# EAGLE design cactusCup_v1 (EAGLE 8.0.0)
A micro-controller designed to fit into an express card slot and become an integrated part of the computer
COMPANY: ADAFRUIT INDUSTRIES; DRAWN: KTOWN; REV: B
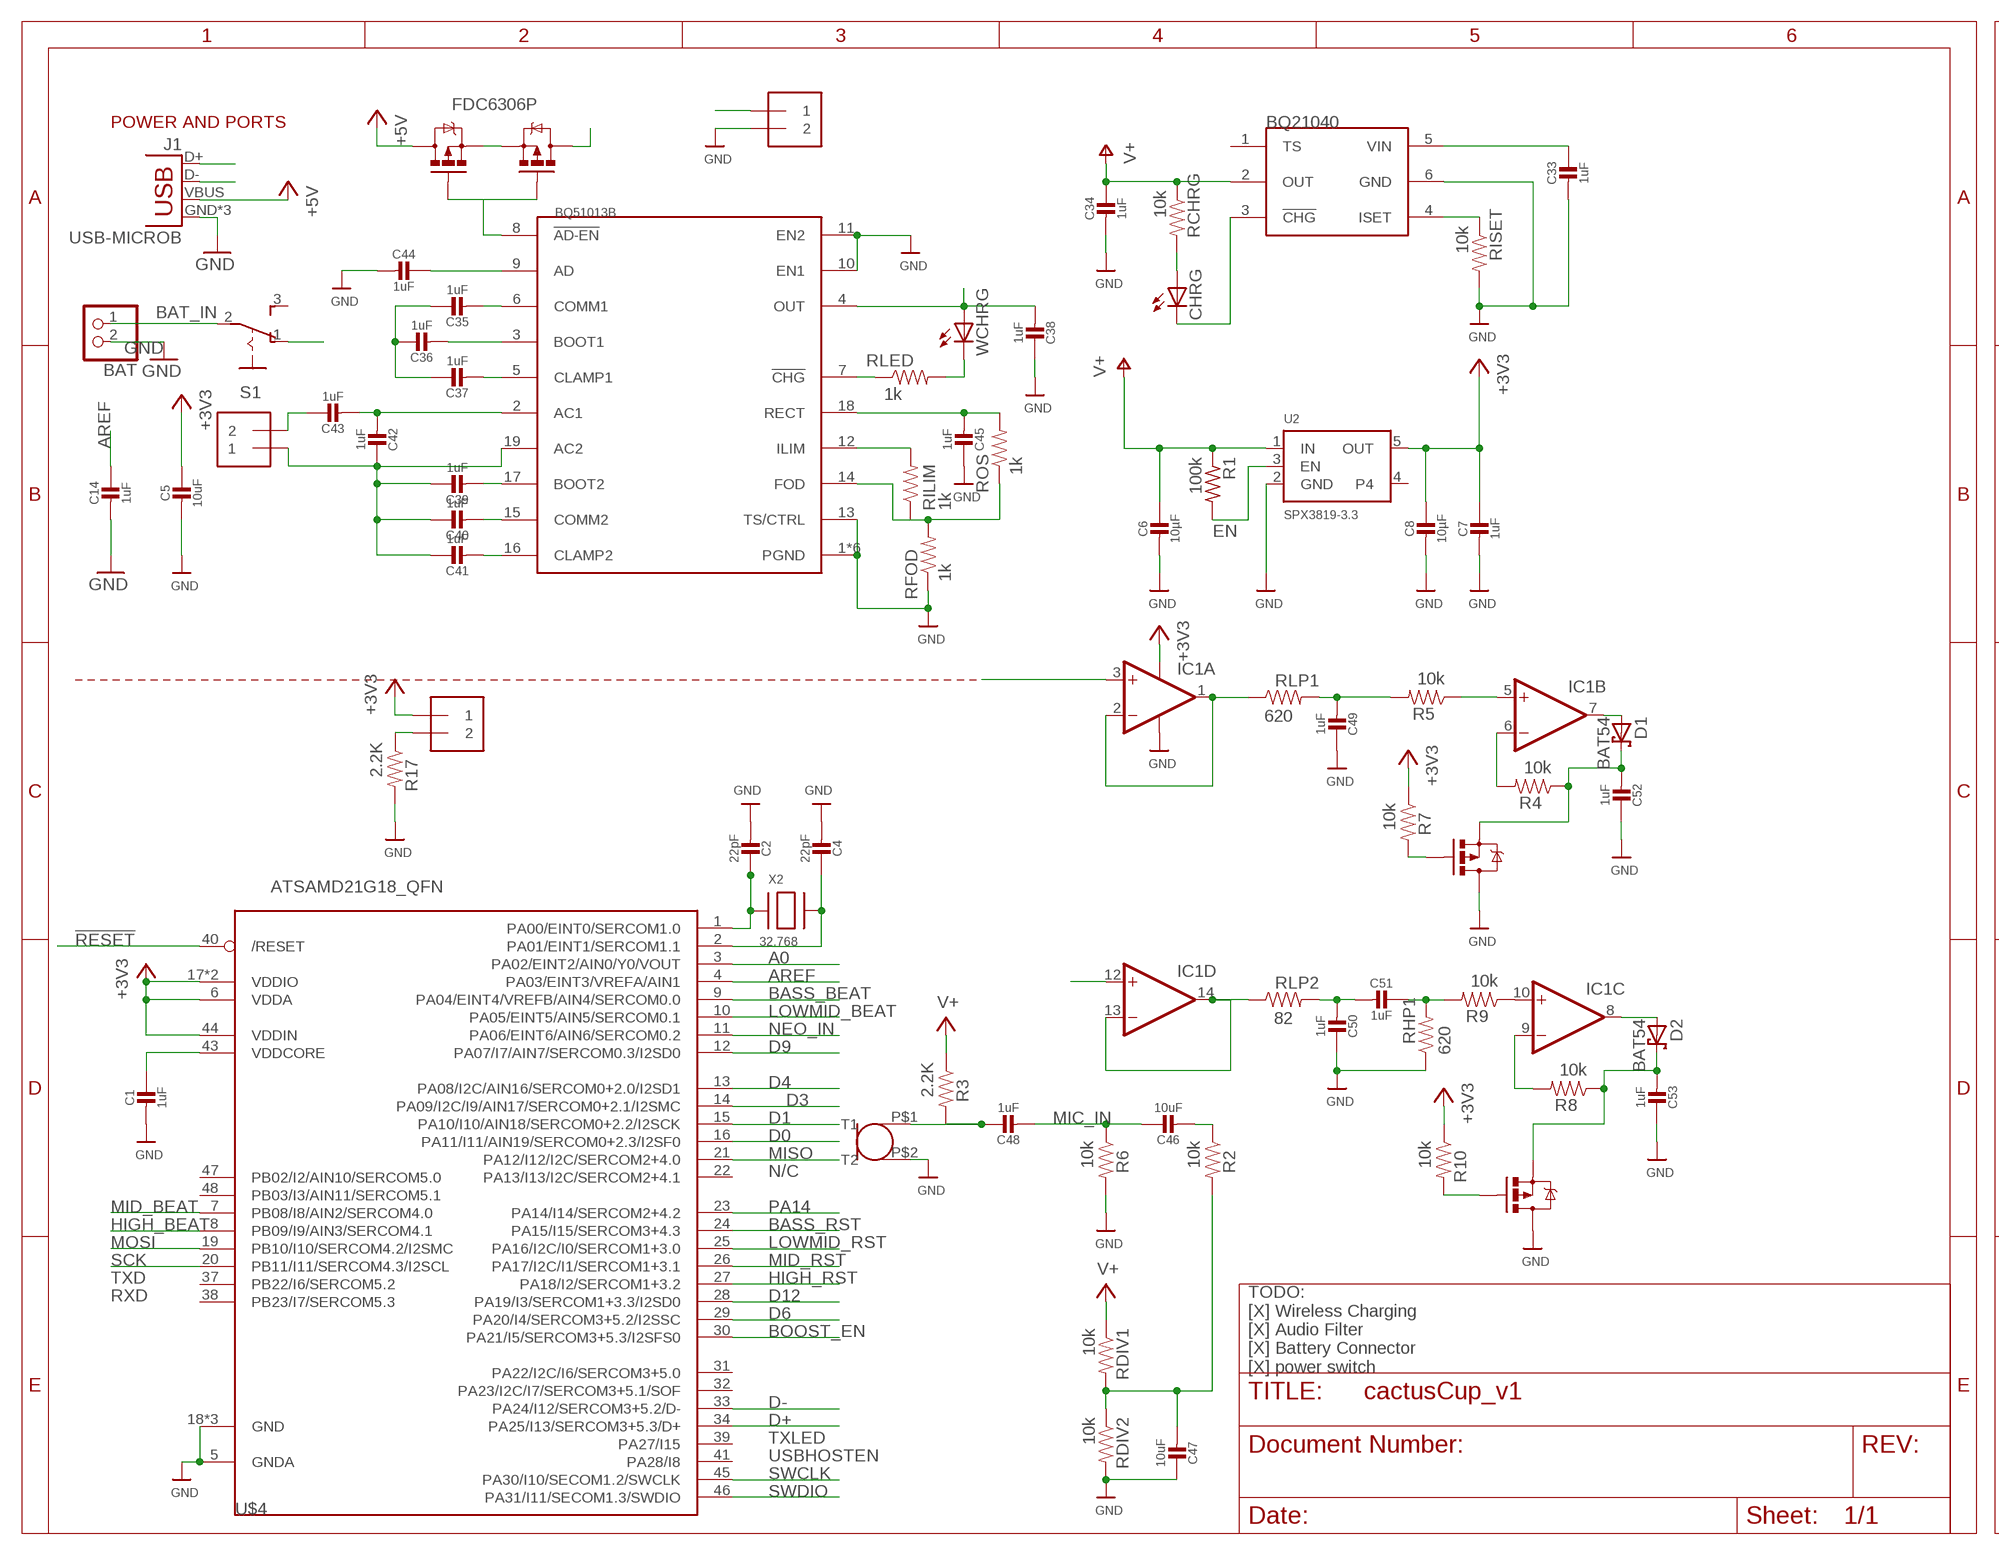
[diagram p0: schematic, sheet 1, part 1 of 2]
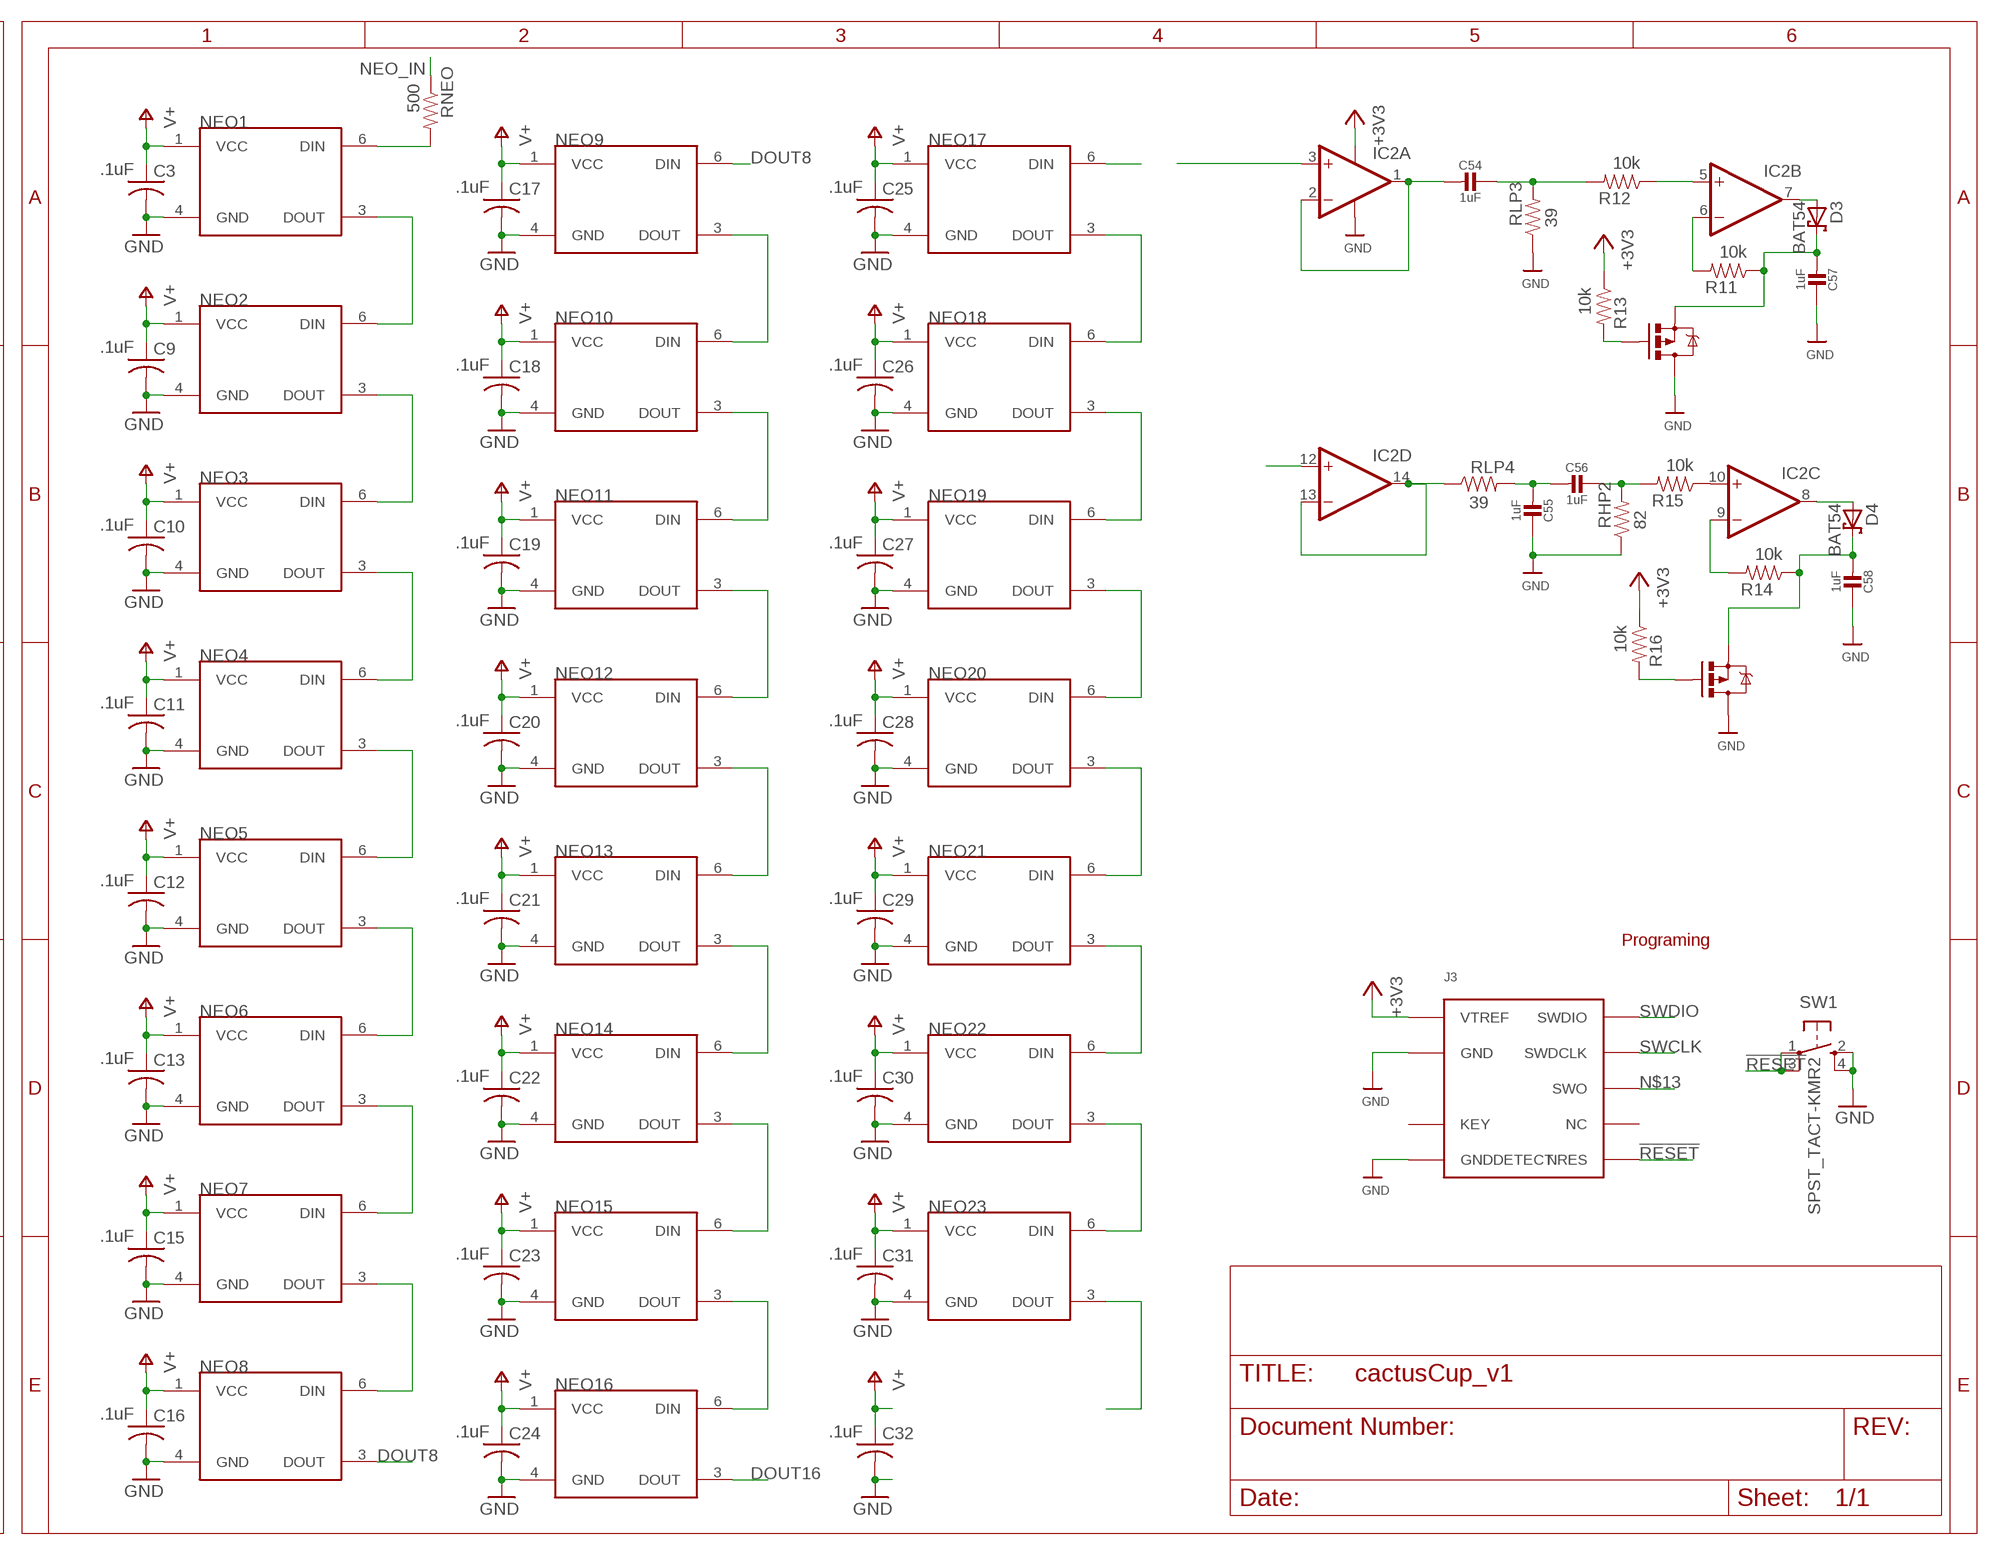
[diagram p1: schematic, sheet 1, part 2 of 2]

## Parts
BAT  JST_2PIN-SMT-RA  [JST-PH-2-SMT-RA]
BQ21040  BQ21040  [SOT23-6]
BQ51013B  BQ51013B  [R-PQFP-N20]
C1  1uF  CAP_CERAMIC0603_NO  [0603-NO]
C2  22pF  CAP_CERAMIC0603_NO  [0603-NO]
C3  .1uF  C-USC0603  [C0603]
C4  22pF  CAP_CERAMIC0603_NO  [0603-NO]
C5  10uF  CAP_CERAMIC0805-NOOUTLINE  [0805-NO]
C6  10µF  CAP_CERAMIC0805-NOOUTLINE  [0805-NO]
C7  1uF  CAP_CERAMIC0603_NO  [0603-NO]
C8  10µF  CAP_CERAMIC0805-NOOUTLINE  [0805-NO]
C9  .1uF  C-USC0603  [C0603]
C10  .1uF  C-USC0603  [C0603]
C11  .1uF  C-USC0603  [C0603]
C12  .1uF  C-USC0603  [C0603]
C13  .1uF  C-USC0603  [C0603]
C14  1uF  CAP_CERAMIC0603_NO  [0603-NO]
C15  .1uF  C-USC0603  [C0603]
C16  .1uF  C-USC0603  [C0603]
C17  .1uF  C-USC0603  [C0603]
C18  .1uF  C-USC0603  [C0603]
C19  .1uF  C-USC0603  [C0603]
C20  .1uF  C-USC0603  [C0603]
C21  .1uF  C-USC0603  [C0603]
C22  .1uF  C-USC0603  [C0603]
C23  .1uF  C-USC0603  [C0603]
C24  .1uF  C-USC0603  [C0603]
C25  .1uF  C-USC0603  [C0603]
C26  .1uF  C-USC0603  [C0603]
C27  .1uF  C-USC0603  [C0603]
C28  .1uF  C-USC0603  [C0603]
C29  .1uF  C-USC0603  [C0603]
C30  .1uF  C-USC0603  [C0603]
C31  .1uF  C-USC0603  [C0603]
C32  .1uF  C-USC0603  [C0603]
C33  1uF  CAP_CERAMIC0603_NO  [0603-NO]
C34  1uF  CAP_CERAMIC0603_NO  [0603-NO]
C35  1uF  CAP_CERAMIC0603_NO  [0603-NO]
C36  1uF  CAP_CERAMIC0603_NO  [0603-NO]
C37  1uF  CAP_CERAMIC0603_NO  [0603-NO]
C38  1uF  CAP_CERAMIC0603_NO  [0603-NO]
C39  1uF  CAP_CERAMIC0603_NO  [0603-NO]
C40  1uF  CAP_CERAMIC0603_NO  [0603-NO]
C41  1uF  CAP_CERAMIC0603_NO  [0603-NO]
C42  1uF  CAP_CERAMIC0603_NO  [0603-NO]
C43  1uF  CAP_CERAMIC0603_NO  [0603-NO]
C44  1uF  CAP_CERAMIC0603_NO  [0603-NO]
C45  1uF  CAP_CERAMIC0603_NO  [0603-NO]
C46  10uF  CAP_CERAMIC0603_NO  [0603-NO]
C47  10uF  CAP_CERAMIC0603_NO  [0603-NO]
C48  1uF  CAP_CERAMIC0603_NO  [0603-NO]
C49  1uF  CAP_CERAMIC0603_NO  [0603-NO]
C50  1uF  CAP_CERAMIC0603_NO  [0603-NO]
C51  1uF  CAP_CERAMIC0603_NO  [0603-NO]
C52  1uF  CAP_CERAMIC0603_NO  [0603-NO]
C53  1uF  CAP_CERAMIC0603_NO  [0603-NO]
C54  1uF  CAP_CERAMIC0603_NO  [0603-NO]
C55  1uF  CAP_CERAMIC0603_NO  [0603-NO]
C56  1uF  CAP_CERAMIC0603_NO  [0603-NO]
C57  1uF  CAP_CERAMIC0603_NO  [0603-NO]
C58  1uF  CAP_CERAMIC0603_NO  [0603-NO]
CHRG  LEDCHIPLED_0603  [CHIPLED_0603]
COIL  1X2-3.5MM  [1X2-3.5MM]
D1  BAT54  [SOT23]
D2  BAT54  [SOT23]
D3  BAT54  [SOT23]
D4  BAT54  [SOT23]
IC1  QUAD_OPAMPTS  [TSSOP14]
IC2  QUAD_OPAMPTS  [TSSOP14]
J1  USB-MICROB  [USB-MICROB]
J2  1X2-3.5MM  [1X2-3.5MM]
J3  JLINK_10PIN  [FTSH-105-01-F-DH]
J4  1X2-3.5MM  [1X2-3.5MM]
NEO1  NEOPIXEL  [RGBLED5050]
NEO2  NEOPIXEL  [RGBLED5050]
NEO3  NEOPIXEL  [RGBLED5050]
NEO4  NEOPIXEL  [RGBLED5050]
NEO5  NEOPIXEL  [RGBLED5050]
NEO6  NEOPIXEL  [RGBLED5050]
NEO7  NEOPIXEL  [RGBLED5050]
NEO8  NEOPIXEL  [RGBLED5050]
NEO9  NEOPIXEL  [RGBLED5050]
NEO10  NEOPIXEL  [RGBLED5050]
NEO11  NEOPIXEL  [RGBLED5050]
NEO12  NEOPIXEL  [RGBLED5050]
NEO13  NEOPIXEL  [RGBLED5050]
NEO14  NEOPIXEL  [RGBLED5050]
NEO15  NEOPIXEL  [RGBLED5050]
NEO16  NEOPIXEL  [RGBLED5050]
NEO17  NEOPIXEL  [RGBLED5050]
NEO18  NEOPIXEL  [RGBLED5050]
NEO19  NEOPIXEL  [RGBLED5050]
NEO20  NEOPIXEL  [RGBLED5050]
NEO21  NEOPIXEL  [RGBLED5050]
NEO22  NEOPIXEL  [RGBLED5050]
NEO23  NEOPIXEL  [RGBLED5050]
R1  100k  R-US_R0603  [R0603]
R2  10k  0.27OHM-1/10W-1%(0603)  [0603-RES]
R3  2.2K  0.27OHM-1/10W-1%(0603)  [0603-RES]
R4  10k  0.27OHM-1/10W-1%(0603)  [0603-RES]
R5  10k  0.27OHM-1/10W-1%(0603)  [0603-RES]
R6  10k  0.27OHM-1/10W-1%(0603)  [0603-RES]
R7  10k  0.27OHM-1/10W-1%(0603)  [0603-RES]
R8  10k  0.27OHM-1/10W-1%(0603)  [0603-RES]
R9  10k  0.27OHM-1/10W-1%(0603)  [0603-RES]
R10  10k  0.27OHM-1/10W-1%(0603)  [0603-RES]
R11  10k  0.27OHM-1/10W-1%(0603)  [0603-RES]
R12  10k  0.27OHM-1/10W-1%(0603)  [0603-RES]
R13  10k  0.27OHM-1/10W-1%(0603)  [0603-RES]
R14  10k  0.27OHM-1/10W-1%(0603)  [0603-RES]
R15  10k  0.27OHM-1/10W-1%(0603)  [0603-RES]
R16  10k  0.27OHM-1/10W-1%(0603)  [0603-RES]
R17  2.2K  0.27OHM-1/10W-1%(0603)  [0603-RES]
RCHRG  10k  0.27OHM-1/10W-1%(0603)  [0603-RES]
RDIV1  10k  0.27OHM-1/10W-1%(0603)  [0603-RES]
RDIV2  10k  0.27OHM-1/10W-1%(0603)  [0603-RES]
RFOD  1k  0.27OHM-1/10W-1%(0603)  [0603-RES]
RHP1  620  0.27OHM-1/10W-1%(0603)  [0603-RES]
RHP2  82  0.27OHM-1/10W-1%(0603)  [0603-RES]
RILIM  1k  0.27OHM-1/10W-1%(0603)  [0603-RES]
RISET  10k  0.27OHM-1/10W-1%(0603)  [0603-RES]
RLED  1k  0.27OHM-1/10W-1%(0603)  [0603-RES]
RLP1  620  0.27OHM-1/10W-1%(0603)  [0603-RES]
RLP2  82  0.27OHM-1/10W-1%(0603)  [0603-RES]
RLP3  39  0.27OHM-1/10W-1%(0603)  [0603-RES]
RLP4  39  0.27OHM-1/10W-1%(0603)  [0603-RES]
RNEO  500  0.27OHM-1/10W-1%(0603)  [0603-RES]
ROS  1k  0.27OHM-1/10W-1%(0603)  [0603-RES]
S1  255SB  [255SB]
SW1  SPST_TACT-KMR2  [KMR2]
U2  SPX3819-3.3  VREG_SOT23-5  [SOT23-5]
U$3  FDC6306P  [SOT-23_6]
U$4  ATSAMD21G18_QFN  ATSAMD21J  [TQFP48]
U$19  CMA-4544PF-W  [CMA_MIC]
U$25  FDC6306P  [SOT-23_6]
U$37  FDC6306P  [SOT-23_6]
WCHRG  LEDCHIPLED_0603  [CHIPLED_0603]
X2  32.768  XTAL-3.2X1.5  [XTAL3215]

## Nets
!AD-EN: BQ51013B.8(!AD-EN) U$3.1(G) U$3.3(G)
!RESET: J3.10(NRES) SW1.1(P) SW1.3(P1) U$4.40(/RESET)
+1V5: C47.2 R2.2 RDIV1.2 RDIV2.1
+3V3: C5.1 C7.1 C8.1 IC1.4(A:V+) IC2.4(A:V+) J2.1 J3.1(VTREF) R3.1 R7.1 R10.1 R13.1 R16.1 RDIV1.1 U2.5(OUT) U$4.6(VDDA) U$4.17(VDDIO) U$4.36(VDDIO) U$4.44(VDDIN) ; supply symbol labelled V+
A0: U$4.3(PA02/EINT2/AIN0/Y0/VOUT)
AREF: C14.1 U$4.4(PA03/EINT3/VREFA/AIN1)
AUDIO_IN: C46.2 IC1.3(A:+IN) IC1.12(D:+IN) IC2.3(A:+IN) IC2.12(D:+IN) R2.1
BASS_BEAT: C52.2 D1.3(C) R4.1 U$4.9(PA04/EINT4/VREFB/AIN4/SERCOM0.0) U$25.5(S)
BASS_RST: R7.2 U$4.24(PA15/I15/SERCOM3+4.3) U$25.1(G)
BAT_IN: BAT.1 S1.2(P)
BOOST_EN: U$4.30(PA21/I5/SERCOM3+5.3/I2SFS0)
D0: U$4.16(PA11/I11/AIN19/SERCOM0+2.3/I2SF0)
D1: U$4.15(PA10/I10/AIN18/SERCOM0+2.2/I2SCK)
D3: U$4.14(PA09/I2C/I9/AIN17/SERCOM0+2.1/I2SMC)
D4: U$4.13(PA08/I2C/AIN16/SERCOM0+2.0/I2SD1)
D6: J2.2 R17.1 U$4.29(PA20/I4/SERCOM3+5.2/I2SSC)
D9: U$4.12(PA07/I7/AIN7/SERCOM0.3/I2SD0)
D12: U$4.28(PA19/I3/SERCOM1+3.3/I2SD0)
D+: J1.D+ U$4.34(PA25/I13/SERCOM3+5.3/D+)
D-: J1.D- U$4.33(PA24/I12/SERCOM3+5.2/D-)
DOUT8: NEO8.3(DOUT) NEO9.6(DIN)
DOUT16: NEO16.3(DOUT) NEO17.6(DIN)
EN: R1.2 U2.3(EN)
GND: BAT.2 BQ21040.6(GND) BQ51013B.1(PGND) BQ51013B.10(EN1) BQ51013B.11(EN2) BQ51013B.13(TS/CTRL) BQ51013B.20(PGND) BQ51013B.E@1(PGND) BQ51013B.E@2(PGND) BQ51013B.E@3(PGND) BQ51013B.E@4(PGND) C1.2 C2.2 C3.2 C4.2 C5.2 C6.2 C7.2 C8.2 C9.2 C10.2 C11.2 C12.2 C13.2 C14.2 C15.2 C16.2 C17.2 C18.2 C19.2 C20.2 C21.2 C22.2 C23.2 C24.2 C25.2 C26.2 C27.2 C28.2 C29.2 C30.2 C31.2 C32.2 C33.2 C34.2 C38.1 C44.2 C45.1 C47.1 C49.1 C50.1 C52.1 C53.1 C55.1 C57.1 C58.1 IC1.11(A:V-) IC2.11(A:V-) J1.GND J1.MT1(GND) J1.MT2(GND) J3.3(GND) J3.5(GND) J3.9(GNDDETECT) J4.2 NEO1.4(GND) NEO2.4(GND) NEO3.4(GND) NEO4.4(GND) NEO5.4(GND) NEO6.4(GND) NEO7.4(GND) NEO8.4(GND) NEO9.4(GND) NEO10.4(GND) NEO11.4(GND) NEO12.4(GND) NEO13.4(GND) NEO14.4(GND) NEO15.4(GND) NEO16.4(GND) NEO17.4(GND) NEO18.4(GND) NEO19.4(GND) NEO20.4(GND) NEO21.4(GND) NEO22.4(GND) NEO23.4(GND) R6.2 R17.2 RDIV2.2 RFOD.1 RHP1.1 RHP2.1 RISET.2 RLP3.1 SW1.2(S) SW1.4(S1) U2.2(GND) U$4.5(GNDA) U$4.18(GND) U$4.35(GND) U$4.42(GND) U$19.P$2(T2) U$25.4(D) U$25.6(D) U$37.4(D) U$37.6(D)
HIGH_BEAT: C57.2 D3.3(C) R11.1 U$4.8(PB09/I9/AIN3/SERCOM4.1) U$37.5(S)
HIGH_RST: R13.2 U$4.27(PA18/I2/SERCOM1+3.2) U$37.1(G)
LOWMID_BEAT: C53.2 D2.3(C) R8.1 U$4.10(PA05/EINT5/AIN5/SERCOM0.1) U$25.2(S)
LOWMID_RST: R10.2 U$4.25(PA16/I2C/I0/SERCOM1+3.0) U$25.3(G)
MIC_IN: C46.1 C48.2 R6.1
MID_BEAT: C58.2 D4.3(C) R14.1 U$4.7(PB08/I8/AIN2/SERCOM4.0) U$37.2(S)
MID_RST: R16.2 U$4.26(PA17/I2C/I1/SERCOM1+3.1) U$37.3(G)
MISO: U$4.21(PA12/I12/I2C/SERCOM2+4.0)
MOSI: U$4.19(PB10/I10/SERCOM4.2/I2SMC)
N$1: NEO1.3(DOUT) NEO2.6(DIN)
N$2: NEO3.3(DOUT) NEO4.6(DIN)
N$3: NEO2.3(DOUT) NEO3.6(DIN)
N$4: NEO5.3(DOUT) NEO6.6(DIN)
N$5: C2.1 U$4.1(PA00/EINT0/SERCOM1.0) X2.P$1
N$6: NEO7.3(DOUT) NEO8.6(DIN)
N$7: C4.1 U$4.2(PA01/EINT1/SERCOM1.1) X2.P$2
N$8: NEO6.3(DOUT) NEO7.6(DIN)
N$9: NEO4.3(DOUT) NEO5.6(DIN)
N$10: NEO9.3(DOUT) NEO10.6(DIN)
N$11: NEO11.3(DOUT) NEO12.6(DIN)
N$12: NEO10.3(DOUT) NEO11.6(DIN)
N$13: J3.6(SWO)
N$14: NEO13.3(DOUT) NEO14.6(DIN)
N$15: NEO15.3(DOUT) NEO16.6(DIN)
N$16: NEO14.3(DOUT) NEO15.6(DIN)
N$17: NEO12.3(DOUT) NEO13.6(DIN)
N$18: NEO17.3(DOUT) NEO18.6(DIN)
N$19: NEO19.3(DOUT) NEO20.6(DIN)
N$20: NEO18.3(DOUT) NEO19.6(DIN)
N$21: NEO21.3(DOUT) NEO22.6(DIN)
N$22: NEO23.3(DOUT)
N$23: NEO22.3(DOUT) NEO23.6(DIN)
N$24: NEO20.3(DOUT) NEO21.6(DIN)
N$25: CHRG.A RCHRG.2
N$26: BQ21040.3(!CHG) CHRG.C
N$27: BQ21040.4(ISET) RISET.1
N$28: NEO1.6(DIN) RNEO.2
N$29: BQ51013B.6(COMM1) C35.2
N$30: U$3.2(S) U$3.5(S)
N$31: BQ51013B.7(!CHG) RLED.1
N$32: C35.1 C36.1 C37.1
N$33: BQ51013B.3(BOOT1) C36.2
N$34: BQ51013B.5(CLAMP1) C37.2
N$35: BQ51013B.2(AC1) C42.2 C43.2
N$36: BQ51013B.19(AC2) C39.1 C40.1 C41.1 C42.1 COIL.1
N$37: BQ51013B.17(BOOT2) C39.2
N$38: BQ51013B.16(CLAMP2) C41.2
N$39: BQ51013B.15(COMM2) C40.2
N$40: BQ51013B.18(RECT) C45.2 ROS.2
N$41: BQ51013B.14(FOD) RFOD.2 RILIM.1 ROS.1
N$42: BQ51013B.12(ILIM) RILIM.2
N$43: C43.1 COIL.2
N$44: C48.1 R3.2 U$19.P$1(T1)
N$45: IC1.1(A:OUT) IC1.2(A:-IN) RLP1.1
N$46: C49.2 R5.2 RLP1.2
N$47: C50.2 C51.2 RLP2.2
N$48: C51.1 R9.2 RHP1.2
N$49: IC1.6(B:-IN) R4.2
N$50: IC1.5(B:+IN) R5.1
N$51: D1.1(A) IC1.7(B:OUT)
N$52: C54.2 IC2.1(A:OUT) IC2.2(A:-IN)
N$53: C54.1 R12.2 RLP3.2
N$54: IC1.10(C:+IN) R9.1
N$55: D2.1(A) IC1.8(C:OUT)
N$56: IC1.9(C:-IN) R8.2
N$57: IC1.13(D:-IN) IC1.14(D:OUT) RLP2.1
N$58: C55.2 C56.2 RLP4.2
N$59: C56.1 R15.2 RHP2.2
N$60: IC2.6(B:-IN) R11.2
N$61: IC2.5(B:+IN) R12.1
N$62: D3.1(A) IC2.7(B:OUT)
N$63: D4.1(A) IC2.8(C:OUT)
N$64: IC2.10(C:+IN) R15.1
N$65: IC2.9(C:-IN) R14.2
N$66: IC2.13(D:-IN) IC2.14(D:OUT) RLP4.1
NEO_IN: RNEO.1 U$4.11(PA06/EINT6/AIN6/SERCOM0.2)
PA14: U$4.23(PA14/I14/SERCOM2+4.2)
SCK: U$4.20(PB11/I11/SERCOM4.3/I2SCL)
SWCLK: J3.4(SWDCLK) U$4.45(PA30/I10/SECOM1.2/SWCLK)
SWDIO: J3.2(SWDIO) U$4.46(PA31/I11/SECOM1.3/SWDIO)
VBAT: BQ21040.2(OUT) C3.1 C6.1 C9.1 C10.1 C11.1 C12.1 C13.1 C15.1 C16.1 C17.1 C18.1 C19.1 C20.1 C21.1 C22.1 C23.1 C24.1 C25.1 C26.1 C27.1 C28.1 C29.1 C30.1 C31.1 C32.1 C34.1 NEO1.1(VCC) NEO2.1(VCC) NEO3.1(VCC) NEO4.1(VCC) NEO5.1(VCC) NEO6.1(VCC) NEO7.1(VCC) NEO8.1(VCC) NEO9.1(VCC) NEO10.1(VCC) NEO11.1(VCC) NEO12.1(VCC) NEO13.1(VCC) NEO14.1(VCC) NEO15.1(VCC) NEO16.1(VCC) NEO17.1(VCC) NEO18.1(VCC) NEO19.1(VCC) NEO20.1(VCC) NEO21.1(VCC) NEO22.1(VCC) NEO23.1(VCC) R1.1 RCHRG.1 S1.1(O) U2.1(IN) ; supply symbol labelled V+
VBUS: BQ21040.5(VIN) BQ51013B.4(OUT) C33.1 C38.2 J4.1 U$3.6(D) WCHRG.A
VDDCORE: C1.1 U$4.43(VDDCORE)
VUSB: BQ51013B.9(AD) C44.1 J1.VBUS U$3.4(D) ; supply symbol labelled +5V
WCHRG: RLED.2 WCHRG.C
Unconnected: BQ21040.1(TS) J3.7(KEY) J3.8(NC) S1.3(S) U2.4 U$4.22(PA13/I13/I2C/SERCOM2+4.1) U$4.31(PA22/I2C/I6/SERCOM3+5.0) U$4.32(PA23/I2C/I7/SERCOM3+5.1/SOF) U$4.37(PB22/I6/SERCOM5.2) U$4.38(PB23/I7/SERCOM5.3) U$4.39(PA27/I15) U$4.41(PA28/I8) U$4.47(PB02/I2/AIN10/SERCOM5.0) U$4.48(PB03/I3/AIN11/SERCOM5.1)

## Notes on the sheet
- POWER AND PORTS
- Programing
- N/C
- TXD
- RXD
- TODO:
  [X] Wireless Charging
  [X] Audio Filter
  [X] Battery Connector
  [X] power switch
- TXLED
- USBHOSTEN

## Library data of the parts
BAT = adafruit:JST_2PIN: JST 2-Pin Connectors of various flavors SMT-RA (S2B-PH-SM4) 4UConnector #17311 SMT (B2B-PH-SM4) THM-RA (S2B-PH) THM (B2B-PH)
BQ21040 = cactuscup:BQ21040
BQ51013B = cactuscup:BQ51013B
C1 C2 C4-C8 C14 C33-C58 = microbuilder:CAP_CERAMIC: Ceramic Capacitors For new designs, use the packages preceded by an '_' character since they are more reliable: The following footprints should be used on most boards: _0402 - Standard footprint for regular board layouts _0603 - Standard footprint for regular board layouts _0805 - Standard footprint for regular board layouts _1206 - Standard footprint for regular board layouts For extremely tight-pitch boards where space is at a premium, the following 'micro-pitch' footprints can be used (smaller pads, no silkscreen outline, etc.): _0402MP - Micro-pitch footprint for very dense/compact boards _0603MP - Micro-pitch footprint for very dense/compact boards _0805MP - Micro-pitch footprint for very dense/compact boards _1206MP - Micro-pitch footprint for very dense/compact boards
C3 C9-C13 C15-C32 = adafruit:C-US: CAPACITOR, American symbol
CHRG WCHRG = led:LED: LED OSRAM: - CHIPLED LG R971, LG N971, LY N971, LG Q971, LY Q971, LO R971, LY R971 LH N974, LH R974 LS Q976, LO Q976, LY Q976 LO Q996 - Hyper CHIPLED LW Q18S LB Q993, LB Q99A, LB R99A - SideLED LS A670, LO A670, LY A670, LG A670, LP A670 LB A673, LV A673, LT A673, LW A673 LH A674 LY A675 LS A676, LA A676, LO A676, LY A676, LW A676 LS A679, LY A679, LG A679 - Hyper Micro SIDELED® LS Y876, LA Y876, LO Y876, LY Y876 LT Y87S - SmartLED LW L88C, LW L88S LB L89C, LB L89S, LG L890 LS L89K, LO L89K, LY L89K LS L896, LA L896, LO L896, LY L896 - TOPLED LS T670, LO T670, LY T670, LG T670, LP T670 LSG T670, LSP T670, LSY T670, LOP T670, LYG T670 LG T671, LOG T671, LSG T671 LB T673, LV T673, LT T673, LW T673 LH T674 LS T676, LA T676, LO T676, LY T676, LB T676, LH T676, LSB T676, LW T676 LB T67C, LV T67C, LT T67C, LS T67K, LO T67K, LY T67K, LW E67C LS E67B, LA E67B, LO E67B, LY E67B, LB E67C, LV E67C, LT E67C LW T67C LS T679, LY T679, LG T679 LS T770, LO T770, LY T770, LG T770, LP T770 LB T773, LV T773, LT T773, LW T773 LH T774 LS E675, LA E675, LY E675, LS T675 LS T776, LA T776, LO T776, LY T776, LB T776 LHGB T686 LT T68C, LB T68C - Hyper Mini TOPLED® LB M676 - Mini TOPLED Santana® LG M470 LS M47K, LO M47K, LY M47K Source: http://www.osram.convergy.de LUXEON: - LUMILED® LXK2-PW12-R00, LXK2-PW12-S00, LXK2-PW14-U00, LXK2-PW14-V00 LXK2-PM12-R00, LXK2-PM12-S00, LXK2-PM14-U00 LXK2-PE12-Q00, LXK2-PE12-R00, LXK2-PE12-S00, LXK2-PE14-T00, LXK2-PE14-U00 LXK2-PB12-K00, LXK2-PB12-L00, LXK2-PB12-M00, LXK2-PB14-N00, LXK2-PB14-P00, LXK2-PB14-Q00 LXK2-PR12-L00, LXK2-PR12-M00, LXK2-PR14-Q00, LXK2-PR14-R00 LXK2-PD12-Q00, LXK2-PD12-R00, LXK2-PD12-S00 LXK2-PH12-R00, LXK2-PH12-S00 LXK2-PL12-P00, LXK2-PL12-Q00, LXK2-PL12-R00 Source: www.luxeon.com KINGBRIGHT: KA-3528ASYC Source: www.kingbright.com
COIL J2 J4 = adafruit:1X2: 3.5mm Terminal block http://www.ladyada.net/library/pcb/eaglelibrary.html
D1-D4 = diode:BAT54: Schottky Diodes Source: Fairchild .. BAT54.pdf
IC1 IC2 = adafruit:QUAD_OPAMP: OP AMP Standard quad package
J1 = SparkFun-Connectors:USB: USB Connectors USB-B-PTH is fully proven SKU : PRT-00139/CONN-08278 USB-miniB is fully proven SKU : PRT-00587 USB-A-PCB is untested. USB-A-H is throughly reviewed, but untested. Spark Fun Electronics SKU : PRT-00437 USB-B-SMT is throughly reviewed, but untested. Needs silkscreen touching up. USB-A-S has not been used/tested USB-MB-H has not been used/tested USB-MICROB has been used. CONN-09505; PROD_ID: CONN-09505
J3 = expresscard:JLINK_10PIN
NEO1-NEO23 = cactuscup:NEOPIXEL
R1 = adafruit:R-US_: RESISTOR, American symbol
R2-R17 RCHRG RDIV1 RDIV2 RFOD RHP1 RHP2 RILIM RISET RLED RLP1-RLP4 RNEO ROS = SparkFun-Resistors:0.27OHM-1/10W-1%(0603): RES-08787; PROD_ID: RES-08787
S1 = switch:255SB: SLIDING SWITCH Distributor Buerklin, 11G810
SW1 = adafruit:SPST_TACT: SMT 6mm switch, EVQQ2 series http://www.ladyada.net/library/eagle
U2 = microbuilder:VREG_SOT23-5: SOT23-5 Fixed Voltage Regulators Part Current Out V Out V In V Dropout θJA (°C/W) TJ (°C) Digikey Part No. ADP121 150mA 3.3V 3.4-5.5V 0.09V @ 150mA -- -- ADP121-AUJZ33R7CT-ND ADP121 150mA 3.0V 3.1-5.5V 0.09V @ 150mA -- -- ADP121-AUJZ30R7CT-ND ADP122 300mA 3.3V 3.4-5.5V 0.085V @ 300mA -- -- ADP122AUJZ-3.3-R7CT-ND ADP1712 300mA 3.3V 3.5-5.5V 0.17V @ 300mA -- -- ADP1712AUJZ-3.3-R7TR-ND AP7311 (Low Cost) 150mA 3.3V 3.5-6V 0.15V @ 150mA -- -- AP7311-33WG-7DICT-ND LD39015M18R 150mA 1.8V 1.9V-5.5V 0.08V @ 100mA -- -- 497-6977-1-ND LP2985A-33DBVR 150mA 3.3V 3.3-16V 0.28V @ 150mA 206 150 296-18479-1-ND MCP1824T-3302E/OT 300mA 3.3V 3.5V-6V 0.2V @ 300mA -- -- MCP1824T-3302E/OTCT-ND MIC5205-2.5YM5 TR 150mA 2.5V 2.7-16V 0.165V @ 150mA -- -- 576-1257-2-ND MIC5205-3.0YM5 TR 150mA 3.0V 3.2V-16V 0.165V @ 150mA -- -- 576-1258-2-ND MIC5205-3.3YM5 TR 150mA 3.3V 3.5V-16V 0.165V @ 150mA -- -- 576-1259-2-ND TPS780330220 150mA 3.3V+2.2V 3.6-5.5V 250mV Max -- -- 296-23332-1-ND TDA3663/N1,135 100mA 3.3V 3.5-45V 0.18V @ 50mA -- -- 568-5343-1-ND Max operating temp can be calculated using θJA, TJ (max junction temperature), and power in watts. Set the "Maximum Ambient Temperature" until it reaches TJ ("Max Junction Temperature"), which is the absolute limit for safe use of the regulator: Heat Sink Temperature Calculator <http://www.daycounter.com/Calculators/Heat-Sink-Temperature-Calculator.phtml> For example, With 12V source into a 3.3V LP2985 and a 30mA load, we are dissipating (12V-3.3V) * 0.03A = 0.261W. With a θJA of 206 °C/W, a TJ of 150°C, and 261mW we can safely use the chip without a heat sink up to 75°C (=147.1°C Junction Temperature).
U$3 U$25 U$37 = expresscard:FDC6306P
U$4 = con-customer:ATSAMD21J
U$19 = cactuscup:CMA-4544PF-W
X2 = adafruit2:XTAL: Low cost SMT crystals, no capacitors included http://www.ladyada.net/library/eagle

## Board
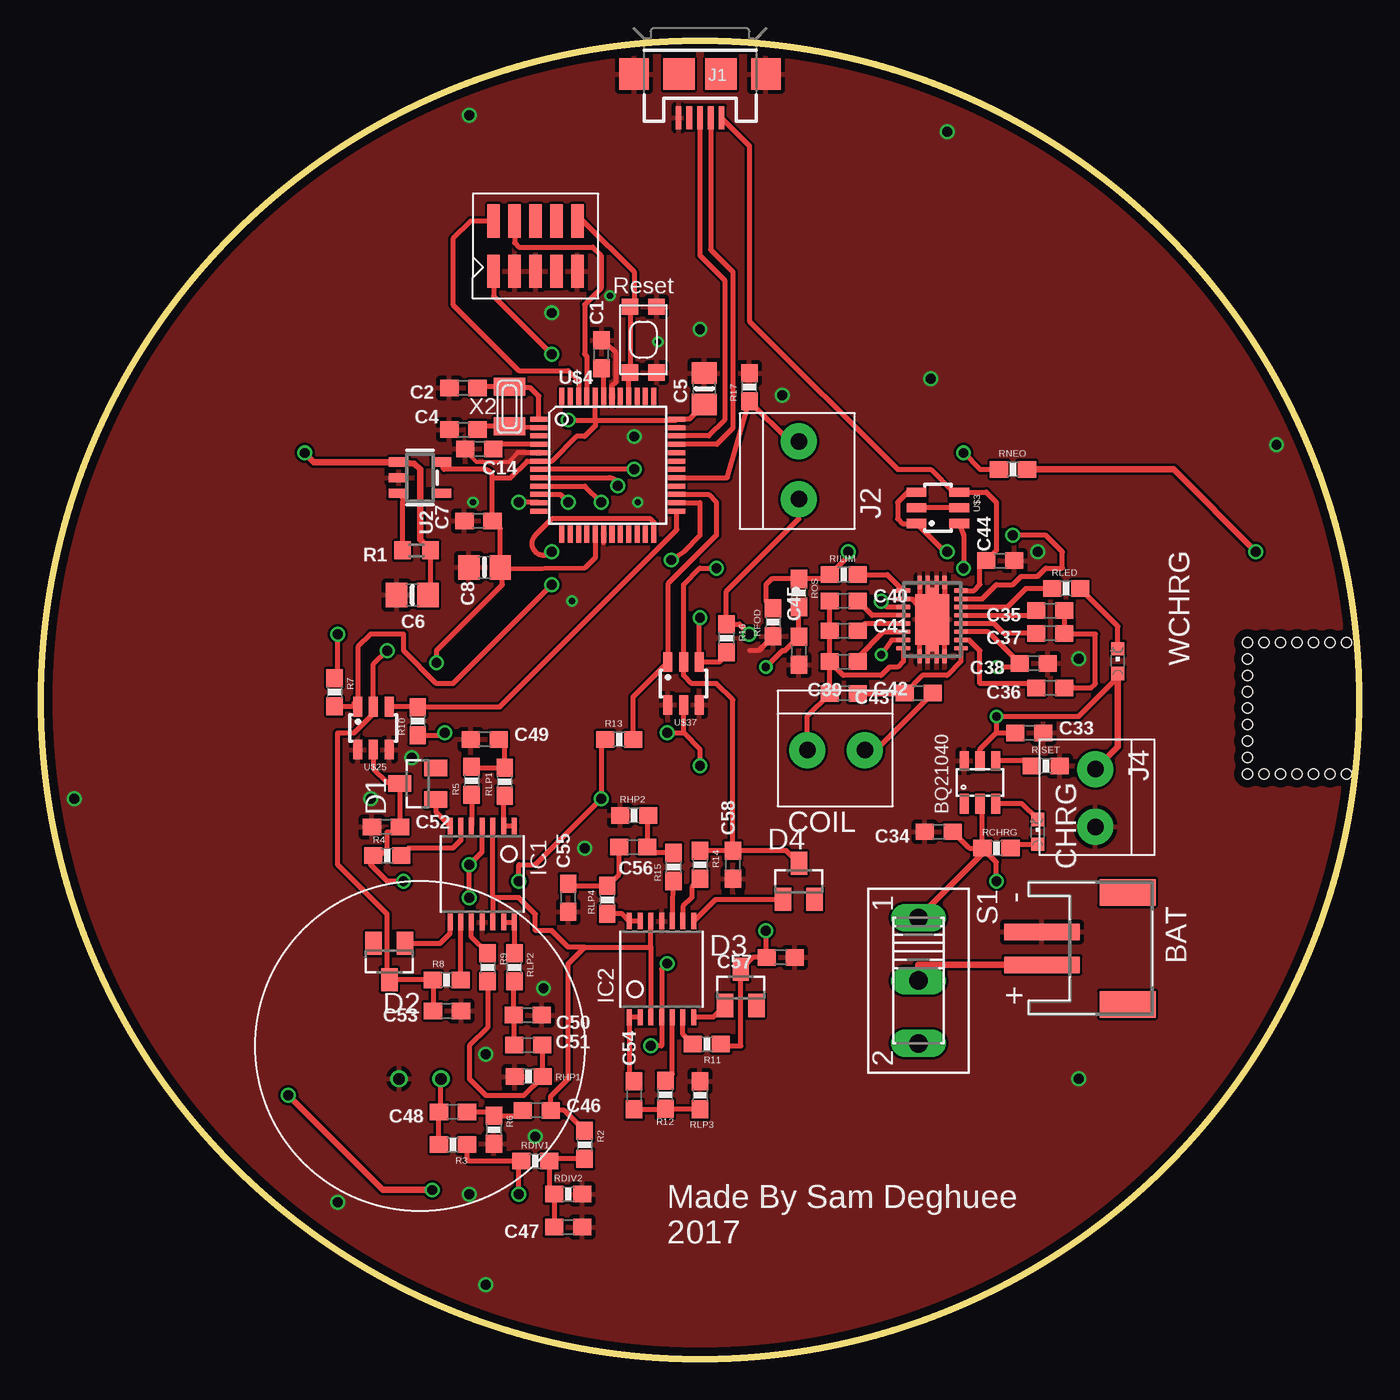
[diagram p2: board, top side]
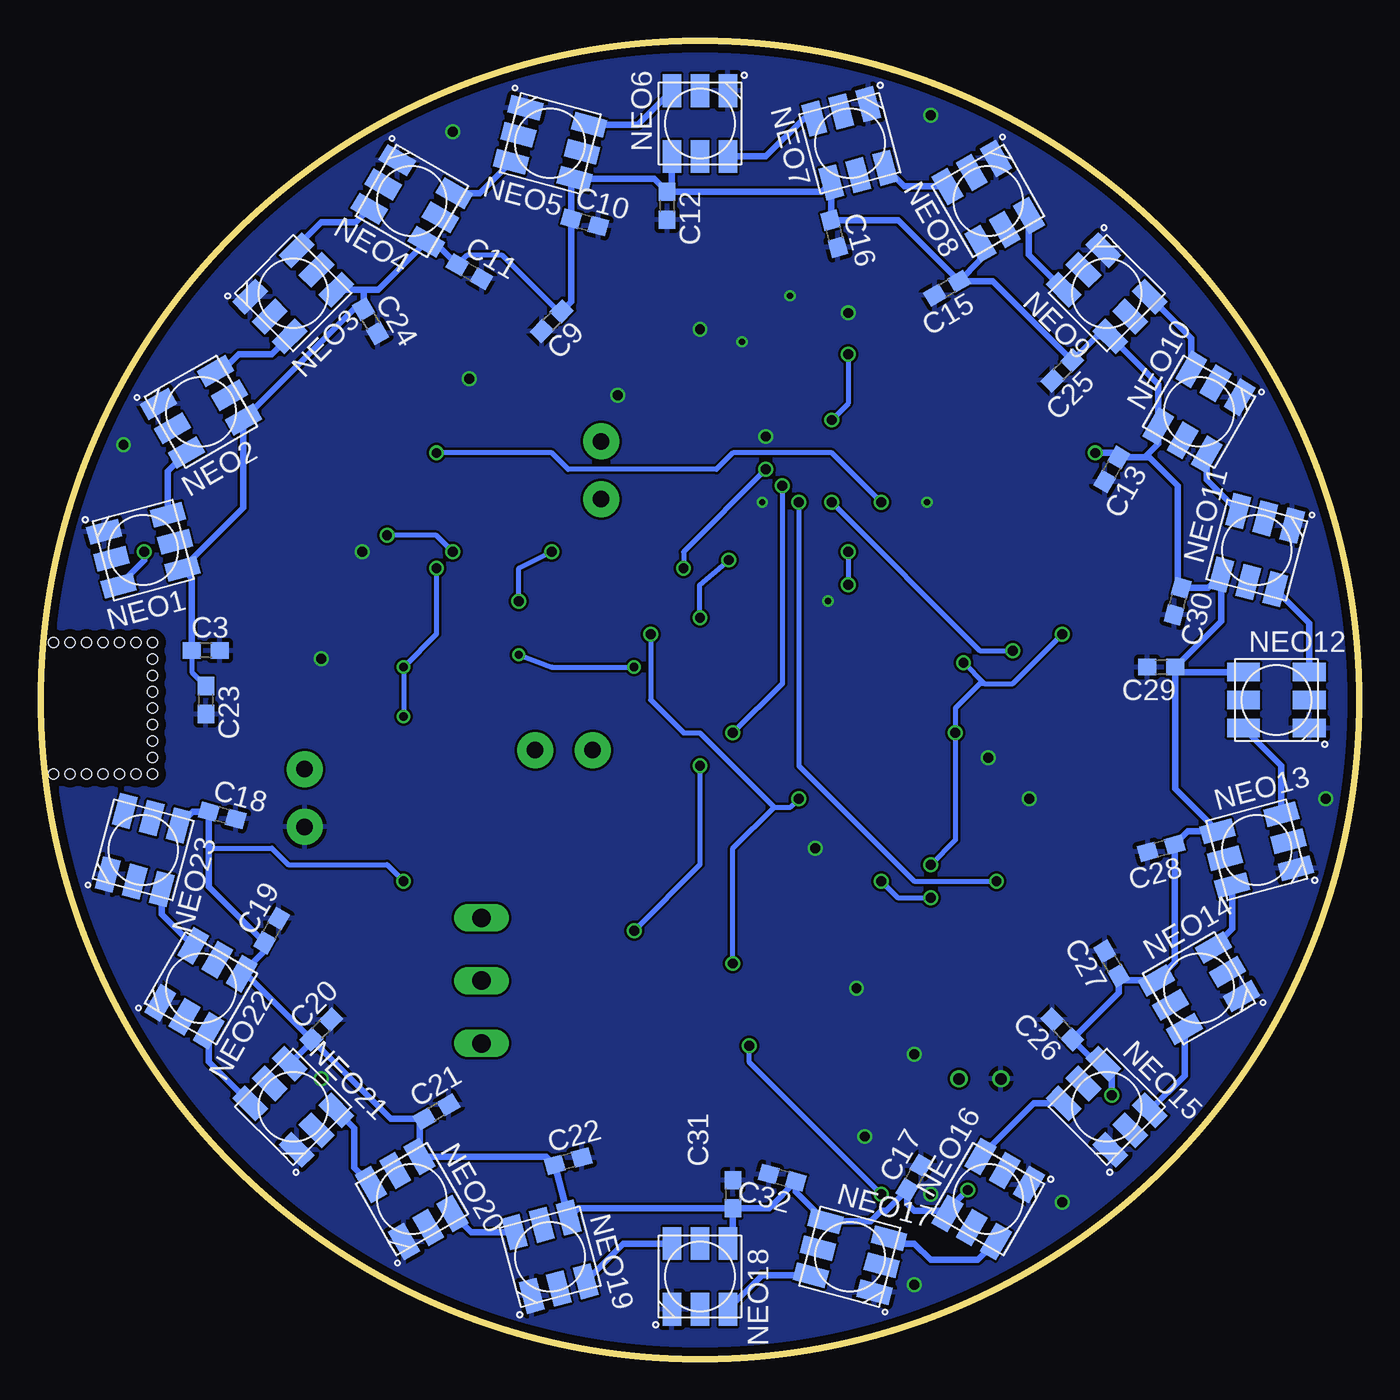
[diagram p3: board, bottom side, seen from below]

Size 80 x 80 mm. Coordinates in mm from the lower left corner, seen from the top.
Outline: circle at 40,40 radius 40
Copper layers (1*16): Top 0.035mm / dielectric 1.6mm / Bottom 0.035mm
Design rules "Elecrow_2-layer_PCB_eagle_rule": minimum track width 6mil, minimum drill 12mil, track to track 6mil, track to pad 6mil, pad to pad 6mil, via to via 8mil, smd to smd 0mil, copper to edge 20mil, drill to drill 10mil, minimum pad ring 6mil, minimum via ring 6mil, stop-mask expansion 0mil, vias tented up to drill 100mil, thermal gap 10mil
Holes 0.6 mm at 79.25,43.5 78.25,43.5 77.25,43.5 76.25,43.5 75.25,43.5 74.25,43.5 73.25,43.5 73.25,42.5 73.25,41.5 73.25,40.5 73.25,39.5 73.25,38.5 73.25,37.5 73.25,36.5 73.25,35.5 74.25,35.5 75.25,35.5 76.25,35.5 77.25,35.5 78.25,35.5 79.25,35.5

### Footprints (pad centres in the part's own frame; a part is rotated, then mirrored left to right if it is on the bottom)
JST-PH-2-SMT-RA = smd 1 x 4.6: 1 1,-3.7; 2 -1,-3.7 | smd 1.6 x 3.4: NC1 -3.4,1.5; NC2 3.4,1.5
SOT23-6 = smd 0.55 x 1.2: 1 -0.95,-1.3; 2 0,-1.3; 3 0.95,-1.3; 4 0.95,1.3; 5 0,1.3; 6 -0.95,1.3
R-PQFP-N20 = smd 0.85 x 0.28: 1 -2.235,-0.75; 10 2.235,-0.75; 11 2.235,0.75; 20 -2.235,0.75 | smd 0.28 x 0.85: 2 -1.75,-1.75; 3 -1.25,-1.75; 4 -0.75,-1.75; 5 -0.25,-1.75; 6 0.25,-1.75; 7 0.75,-1.75; 8 1.25,-1.75; 9 1.75,-1.75; 12 1.75,1.75; 13 1.25,1.75; 14 0.75,1.75; 15 0.25,1.75; 16 -0.25,1.75; 17 -0.75,1.75; 18 -1.25,1.75; 19 -1.75,1.75 | smd 3.05 x 2.05: E@1 0,0 | smd 3.85 x 0.5: E@2 0,0 | smd 5.3 x 0.23: E@3 0,0.275; E@4 0,-0.275
0603-NO = smd 1.1 x 1: 1 -0.85,0; 2 0.85,0
C0603 = smd 1.1 x 1: 1 -0.85,0; 2 0.85,0
0805-NO = smd 1.3 x 1.5: 1 -0.95,0; 2 0.95,0
CHIPLED_0603 = smd 0.8 x 0.8: A 0,-0.75; C 0,0.75
1X2-3.5MM = drill 1 pad 2.184: 1 1.8,0; 2 -1.7,0
SOT23 = smd 1 x 1.4: 1 -0.95,-1.1; 2 0.95,-1.1; 3 0,1.1
TSSOP14 = smd 0.305 x 0.991: 1 -1.95,-2.918; 2 -1.3,-2.918; 3 -0.65,-2.918; 4 0,-2.918; 5 0.65,-2.918; 6 1.3,-2.918; 7 1.95,-2.918; 8 1.95,2.918; 9 1.3,2.918; 10 0.65,2.918; 11 0,2.918; 12 -0.65,2.918; 13 -1.3,2.918; 14 -1.95,2.918
USB-MICROB = smd 0.35 x 1.4: D+ 0,2.65; D- -0.65,2.65; GND 1.3,2.65; ID 0.65,2.65; VBUS -1.3,2.65 | smd 1.8 x 1.9: MT1 -4,0; MT2 4,0 | smd 1.9 x 1.9: P$1 -1.27,0; P$2 1.27,0
FTSH-105-01-F-DH = smd 0.76 x 2.03: 1 2.54,1.525; 2 2.54,-1.525; 3 1.27,1.525; 4 1.27,-1.525; 5 0,1.525; 6 0,-1.525; 7 -1.27,1.525; 8 -1.27,-1.525; 9 -2.54,1.525; 10 -2.54,-1.525
RGBLED5050 = smd 2 x 1.1: 1 -2,1.7; 2 -2,0; 3 -2,-1.7; 4 2,-1.7; 5 2,0; 6 2,1.7
R0603 = smd 1 x 1.1: 1 -0.85,0; 2 0.85,0
0603-RES = smd 1.1 x 1: 1 -0.85,0; 2 0.85,0
255SB = drill 1.118 long: 1 -3.81,0; 2 0,0; 3 3.81,0
KMR2 = smd 1 x 1: 1 2,0.8; 2 2,-0.8; 3 -2,0.8; 4 -2,-0.8
SOT23-5 = smd 0.55 x 1.2: 1 -0.95,-1.3; 2 0,-1.3; 3 0.95,-1.3; 4 0.95,1.3; 5 -0.95,1.3
SOT-23_6 = smd 0.55 x 1.2: 1 0.95,-1.3; 2 0,-1.3; 3 -0.95,-1.3; 4 -0.95,1.3; 5 0,1.3; 6 0.95,1.3
TQFP48 = smd 1.016 x 0.305: 1 -4.191,2.794; 2 -4.191,2.286; 3 -4.191,1.778; 4 -4.191,1.27; 5 -4.191,0.762; 6 -4.191,0.254; 7 -4.191,-0.254; 8 -4.191,-0.762; 9 -4.191,-1.27; 10 -4.191,-1.778; 11 -4.191,-2.286; 12 -4.191,-2.794; 25 4.191,-2.794; 26 4.191,-2.286; 27 4.191,-1.778; 28 4.191,-1.27; 29 4.191,-0.762; 30 4.191,-0.254; 31 4.191,0.254; 32 4.191,0.762; 33 4.191,1.27; 34 4.191,1.778; 35 4.191,2.286; 36 4.191,2.794 | smd 0.305 x 1.016: 13 -2.794,-4.191; 14 -2.286,-4.191; 15 -1.778,-4.191; 16 -1.27,-4.191; 17 -0.762,-4.191; 18 -0.254,-4.191; 19 0.254,-4.191; 20 0.762,-4.191; 21 1.27,-4.191; 22 1.778,-4.191; 23 2.286,-4.191; 24 2.794,-4.191; 37 2.794,4.191; 38 2.286,4.191; 39 1.778,4.191; 40 1.27,4.191; 41 0.762,4.191; 42 0.254,4.191; 43 -0.254,4.191; 44 -0.762,4.191; 45 -1.27,4.191; 46 -1.778,4.191; 47 -2.286,4.191; 48 -2.794,4.191
CMA_MIC = drill 0.7: P$1 -1.27,2; P$2 1.27,2
XTAL3215 = smd 1.1 x 1.9: P$1 1.2,0; P$2 -1.2,0

### Placement (x,y rotation side)
BAT  64.46,24.92 270 top
BQ21040  57,35 0 top
BQ51013B  54.1,44.89 90 top
C1  34.02,60.99 90 top
C2  25.64,58.95 180 top
C3  70,43 0 bottom
C4  25.64,56.41 180 top
C5  40.26,58.9 90 top
C6  22.53,46.38 180 top
C7  26.55,50.88 180 top
C8  26.92,48.05 180 top
C9  49,63 225 bottom
C10  47,69 345 bottom
C11  54,66 330 bottom
C12  42,70 270 bottom
C13  15,54 240 bottom
C14  26.61,55.25 180 top
C15  25,65 210 bottom
C16  31.85,68.31 285 bottom
C17  27,11 60 bottom
C18  69,33 345 bottom
C19  66,26 60 bottom
C20  63,20 45 bottom
C21  56,15 30 bottom
C22  48,12 15 bottom
C23  70,40 270 bottom
C24  60,63 300 bottom
C25  18,60 225 bottom
C26  18,20 135 bottom
C27  15,24 120 bottom
C28  12,31 195 bottom
C29  12,42 180 bottom
C30  11,46 255 bottom
C31  38,9.99 90 bottom
C32  35,11 165 bottom
C33  60,38 0 top
C34  54.5,32 180 top
C35  61.27,45.43 180 top
C36  61.27,40.74 180 top
C37  61.27,44.05 180 top
C38  60.27,42.23 180 top
C39  48.73,42.33 0 top
C40  48.73,46.02 0 top
C41  48.73,44.2 0 top
C42  48.73,40.39 0 top
C43  53.27,40.42 180 top
C44  58.23,48.46 0 top
C45  46,43 90 top
C46  30.09,15.08 0 top
C47  32,8 180 top
C48  25,15 0 top
C49  26.93,37.61 0 top
C50  29.54,20.87 180 top
C51  29.57,19.04 180 top
C52  20.93,32.3 0 top
C53  24.64,21.12 180 top
C54  36,16 90 top
C55  32,28 90 top
C56  35.94,31.06 180 top
C57  44.91,24.37 180 top
C58  42,30 90 top
CHRG  60.5,32 0 top
COIL  48.32,36.96 180 top
D1  22.86,34.92 90 top
D2  21.14,24.12 180 top
D3  42.47,22.55 0 top
D4  46,29 0 top
IC1  26.77,29.43 180 top
IC2  37.67,23.66 0 top
J1  40,78 180 top
J2  46,54 270 top
J3  30.01,67.56 180 top
J4  64,34 90 top
NEO1  73.8,49.1 195 bottom
NEO2  70.3,57.5 210 bottom
NEO3  64.7,64.7 225 bottom
NEO4  57.5,70.3 150 bottom
NEO5  49.1,73.8 165 bottom
NEO6  40,75 90 bottom
NEO7  30.9,73.8 105 bottom
NEO8  22.5,70.3 120 bottom
NEO9  15.3,64.7 135 bottom
NEO10  9.7,57.5 60 bottom
NEO11  6.2,49.1 75 bottom
NEO12  5,40 0 bottom
NEO13  6.2,30.9 15 bottom
NEO14  9.7,22.5 30 bottom
NEO15  15.3,15.3 315 bottom
NEO16  22.5,9.7 60 bottom
NEO17  30.9,6.2 345 bottom
NEO18  40,5 270 bottom
NEO19  49.1,6.2 285 bottom
NEO20  57.5,9.7 300 bottom
NEO21  64.7,15.3 315 bottom
NEO22  70.3,22.5 240 bottom
NEO23  73.8,30.9 255 bottom
R1  22.79,49.08 180 top
R2  33,13 270 top
R3  25,13 180 top
R4  21.01,30.55 0 top
R5  26.14,35.09 90 top
R6  27.49,13.91 270 top
R7  17.81,40.48 270 top
R8  24.62,23 0 top
R9  27.1,23.77 270 top
R10  22.86,38.72 90 top
R11  40.42,19.11 180 top
R12  37.89,16.03 270 top
R13  35.09,37.6 0 top
R14  40,30 270 top
R15  38.4,29.86 90 top
R16  41.6,43.75 270 top
R17  43,59 90 top
RCHRG  58,31 0 top
RDIV1  30,12 0 top
RDIV2  32,10 0 top
RFOD  44.44,44.73 90 top
RHP1  29.59,17.14 0 top
RHP2  36,33 0 top
RILIM  48.73,47.61 0 top
RISET  61,36 0 top
RLED  62.23,46.77 0 top
RLP1  28.15,35.04 90 top
RLP2  28.73,23.77 270 top
RLP3  40,16 270 top
RLP4  34.37,27.86 90 top
RNEO  59,54 0 top
ROS  46,46.5 270 top
S1  53.26,22.96 270 top
SW1  36.56,61.88 90 top
U2  23,53.5 270 top
U$3  54.45,51.67 270 top
U$4  34.4,54.26 0 top
U$19  23,19 180 top
U$25  20.17,38.29 180 top
U$37  39,41 180 top
WCHRG  65.37,42.36 0 top
X2  28.43,57.81 90 top

### Tracks (layer width: path | path; a pad name or v marks a point on that pad's centre or on a via)
!AD-EN  (via drill 0.6)
  Top 0.305: BQ51013B.8 57.14,46.14 58,47 59,47 59.5,47.5 60.5,47.5 61,48 62,48 62,49 61,50 v59,50 | U$3.3 52.62,52.62 52,52 52,51 52.29,50.72 U$3.1 54.86,49 v55,49
  Bottom 0.305: v55,49 56,50 v59,50
!RESET
  Top 0.305: U$4.40 35.67,59.88 SW1.3 SW1.1 36,64.11 36,66 32.92,69.08 J3.10
+1V5
  Top 0.305: R2.2 31,12.15 RDIV1.2 30.85,10.3 RDIV2.1 C47.2
+3V3  (via drill 0.6)
  Top 0.305: 24.15,54.29 U2.5 24.44,54 26.89,54 arc-90 27.4,53.49 | 27.4,53.49 C7.1 27.87,50.41 C8.1 28,47.93 | 33.64,57 U$4.44 | 33.64,57 33.64,56.64 33,56 32.5,56 31.01,54.51 U$4.6 29.51,54.51 28.49,53.49 27.4,53.49 | C5.1 39.36,57.05 U$4.36 38.54,57 33.64,57 | U$4.17 33.64,48.64 33,48 28,47.93 | J3.1 27.47,64.53 v31,61 | v32,57 33.64,57 | R3.1 25.85,12.15 26,12 RDIV1.1 29,11.85 v29,10 | v38,24 37.67,23.67 IC2.4 37.67,19 v37,19 | R13.1 34,37.36 v34,34 30,30 29,30 v29,29 | v43,44 42.4,44.6 R16.1 41.6,46.6 46,51 J2.1 | R10.1 24.37,37.87 v24.5,38 | IC1.4 26.78,30.77 v26,30 v26,28 | R7.1 18,41.52 v18,44 | 28,47.93 28,47 24,43 v24,42.25
  Bottom 0.305: v31,61 31,58 v32,57 | v38,24 38,31 35.5,33.5 | v43,44 43,40 41,38 40,38 35.5,33.5 | v26,30 24.5,31.5 v24.5,38 24.5,39.5 23,41 22.75,41 | v18,44 21,41 22.75,41 | v29,29 28,28 v26,28 | v24,42.25 22.75,41 | v29,10 37,18 v37,19 | 35.5,33.5 34.5,33.5 v34,34
AREF
  Top 0.305: U$4.4 27.74,55.53 C14.1
AUDIO_IN
  Top 0.305: 27.43,28 IC1.3 | 27.43,28 IC1.12 | C46.2 31.77,15.08 R2.1 | 37.02,25 IC2.3 | 37.02,25 IC2.12 | C46.2 31,15.13 | 27.43,28 29,28 30,27 30,26 31,26 32,25 33,25 | 33,25 37.02,25 | C46.2 30.94,15.94 32,17 32,24 33,25
BASS_BEAT  (via drill 0.6)
  Top 0.305: U$25.5 20.17,35.83 21,35 21.68,35 D1.3 21.76,32.32 C52.2 21.48,32 21,32 21,31 20.55,30.55 R4.1 20,30.39 20,30 21,29 v22,29 | U$4.9 33.01,52.99 v34,52
  Bottom 0.305: v22,29 27,29 34,36 v34,52
BASS_RST  (via drill 0.6)
  Top 0.305: U$25.1 17.84,39.59 R7.2 | 19,39.82 U$25.1 | v31,47 25,41 24,41 22,43 22,44 20,44 19.22,43.22 U$25.1 | U$4.24 37.2,50.8 37,51 31,51 30,50 arc180 v31,49
  Bottom 0.305: v31,49 v31,47
BAT_IN
  Top 0.406: BAT.1 53.26,23.92 S1.2
D6
  Top 0.305: U$4.29 41.66,53.49 R17.1 45.45,55.7 J2.2
D+
  Top 0.305: J1.D+ 40,67 41.5,65.5 41.5,57 40.53,56.03 U$4.34
D-
  Top 0.305: J1.D- 40.65,67.35 42,66 42,56.5 41.03,55.53 U$4.33
DOUT8
  Bottom 0.406: NEO9.6 20.03,67.02 NEO8.3
DOUT16
  Bottom 0.406: NEO16.3 23.15,6 26,6 27,7 28.2,7 NEO17.6
EN
  Top 0.305: R1.2 21.94,52 arc90 U2.3
GND  (via drill 0.38, 0.6)
  Top 0.254: 28.94,55.02 28.38,54.44 26.43,54.44 25.76,55.14
  Top 0.305: U$4.18 34.15,49.56 | U$4.5 28.94,55.02 | U$4.42 34.66,59.08 34.91,59.34 34.91,61.08 C1.2 | 25.76,55.14 C14.2 | BQ51013B.1 54.85,44.42 BQ51013B.E@4 | BQ51013B.20 53.35,44.14 BQ51013B.E@2 | BQ51013B.13 52.85,46.14 53.35,45.64 | 53.35,45.64 BQ51013B.E@2 | BQ51013B.11 53.35,45.64 | BQ51013B.10 54.85,45.37 BQ51013B.E@4 | BQ51013B.E@2 BQ51013B.E@3 | BQ51013B.E@2 BQ51013B.E@4 | BQ51013B.E@2 | RFOD.1 43.57,43 43,43
  other vias: 37.45,61.75 34.53,64.54 26.22,52 33,31 20,34 27,18.5 30,13.5 63,42.5 60.5,49 22.5,36.5 2,34 63,17 26,10 30.5,22.5 18,9.5 27,4.5 55,74.5 26,75.5 54,59.5 75,55.5 45,58.5 40,62.5 36,56 31,63.5 32.22,46 36.22,52
  pour Top: 114.25,-35.5 114.25,109.5 -33.75,109.5 -33.75,-34.5 2.25,-34.5
  pour Bottom: -46.75,117.5 113.25,117.5 113.25,-34.5 -46.75,-34.5
HIGH_BEAT  (via drill 0.6)
  Top 0.305: R11.1 41.38,19 42.5,19 42.47,19.03 D3.3 43.2,24.37 C57.2 44,24.43 v44,26 | 39,38 U$37.5 | 39,38 40,37 v40,36 | U$4.8 34.51,53.49 arc-90 v35,53 | v38,38 39,38
  Bottom 0.305: v40,36 40,30 v44,26 | v35,53 35,41 v38,38
HIGH_RST
  Top 0.305: R13.2 35.94,40.19 U$37.1 38.05,47.05 41,50 41,52 40.52,52.48 U$4.27
LOWMID_BEAT  (via drill 0.6)
  Top 0.305: C53.2 23.79,22.98 R8.1 23.75,23.02 D2.3 21,23.16 21,27 18,30 18,38 19,38 20.17,39.17 U$25.2 20.17,42.17 v21,43 | U$4.10 31.52,52.48 v32,52
  Bottom 0.305: v32,52 23,43 v21,43
LOWMID_RST
  Top 0.305: U$25.3 22.84,39.59 R10.2 27.82,39.57 38.59,50.34 U$4.25
MIC_IN
  Top 0.305: C48.2 27.24,15 R6.1 28.92,14.76 C46.1
MID_BEAT  (via drill 0.6)
  Top 0.305: D4.3 45.25,30.85 C58.2 | v36,54 U$4.7 | C58.2 R14.1 | C58.2 42,40 41,41 39.5,41 39,41.5 U$37.2 39,47 40,48 v41,48
  Bottom 0.305: v41,48 41,49 v36,54
MID_RST  (via drill 0.6)
  Top 0.305: R16.2 41.19,42.3 U$37.3 39.95,44.95 v40,45 | v38.25,48.5 39,49 40,50 40,52 39.97,51.97 U$4.26
  Bottom 0.305: v40,45 40,47 v38.25,48.5
N$1
  Bottom 0.406: NEO1.3 72.31,53.9 NEO2.6
N$2
  Bottom 0.406: NEO3.3 64.49,67.51 63,69 60.91,69 NEO4.6
N$3
  Bottom 0.406: NEO2.3 69.03,59.97 68,61 66,61 NEO3.6
N$4
  Bottom 0.406: NEO5.3 43.78,74.92 NEO6.6
N$5
  Top 0.305: U$4.1 30.21,58.45 29.7,58.96 28.49,58.96 X2.P$1 26.55,59.01 C2.1
N$6
  Bottom 0.406: NEO7.3 27.61,71.18 NEO8.6
N$7
  Top 0.305: U$4.2 28.72,56.55 X2.P$2 26.69,56.61 C4.1
N$8
  Bottom 0.406: NEO6.3 36,73 33.71,75.29 NEO7.6
N$9
  Bottom 0.406: NEO4.3 53.38,70.77 NEO5.6
N$10
  Bottom 0.406: NEO9.3 10.17,61.98 NEO10.6
N$11
  Bottom 0.406: NEO11.3 3,44.65 NEO12.6
N$12
  Bottom 0.406: NEO11.6 9.23,53.38 NEO10.3
N$14
  Bottom 0.406: NEO14.6 7.69,26.1 NEO13.3
N$15
  Bottom 0.406: NEO16.6 19.74,15.51 NEO15.3
N$16
  Bottom 0.406: NEO15.6 10.58,17.19 NEO14.3
N$17
  Bottom 0.406: NEO12.3 4.71,36.01 NEO13.6
N$18
  Bottom 0.406: NEO17.3 36.22,5.08 NEO18.6
N$19
  Bottom 0.406: NEO19.3 53.9,7.69 NEO20.6
N$20
  Bottom 0.406: NEO18.3 44.65,7 NEO19.6
N$21
  Bottom 0.406: NEO21.3 69.83,18.02 NEO22.6
N$23
  Bottom 0.406: NEO22.3 72.68,26.99 NEO23.6
N$24
  Bottom 0.406: NEO21.6 61,14 61,11.61 NEO20.3
N$25
  Top 0.305: RCHRG.2 59.1,31.25 CHRG.A
N$26
  Top 0.305: CHRG.C 59.55,33.7 BQ21040.3
N$27
  Top 0.305: RISET.1 59.85,36.3 BQ21040.4
N$28  (via drill 0.6)
  Top 0.406: v73.75,49 68.75,54 RNEO.2
  Bottom 0.406: NEO1.6 73.75,48.48 v73.75,49
N$29
  Top 0.305: BQ51013B.6 60.14,45.14 C35.2
N$30
  Top 0.305: U$3.5 U$3.2
N$31
  Top 0.305: RLED.1 59.77,46.77 58.64,45.64 BQ51013B.7
N$32
  Top 0.305: 62.74,40.74 C36.1 63.74,40.74 64,41 64,44 62.17,44 C37.1 C35.1
N$33
  Top 0.305: C36.2 60.16,41 57,41 57,43 56.36,43.64 BQ51013B.3
N$34
  Top 0.305: C37.2 58.45,44.05 57.86,44.64 BQ51013B.5
N$35
  Top 0.305: C42.2 52.4,40.39 C43.2 53.5,41.5 55,41.5 55.85,42.35 BQ51013B.2
N$36
  Top 0.305: BQ51013B.19 52.35,42.35 52,42 51.5,42 51,41.5 48.7,41.5 C39.1 | C39.1 C42.1 46.52,39.03 COIL.1 | C39.1 C41.1 C40.1
N$37
  Top 0.305: C39.2 49.58,42.58 51.14,44.14 BQ51013B.17
N$38
  Top 0.305: BQ51013B.16 50.01,44.64 C41.2
N$39
  Top 0.305: BQ51013B.15 50.45,45.14 C40.2
N$40  (via drill 0.5)
  Top 0.305: ROS.2 C45.2 45.15,43 45,43 v44,42 | BQ51013B.18 51.64,43.64 v51,42.75
  Bottom 0.305: v51,42.75 49,42 v44,42
N$41  (via drill 0.6)
  Top 0.305: RFOD.2 44,46.02 44,47 44.35,47.35 ROS.1 47.62,47.35 RILIM.1 49,48.74 v49,49 | BQ51013B.14 51.36,45.64 v51,46
  Bottom 0.305: v51,46 51,48 v49,49
N$42
  Top 0.305: RILIM.2 51.37,47.61 BQ51013B.12
N$43
  Top 0.305: COIL.2 50.66,36.96 C43.1
N$44
  Top 0.305: R3.2 C48.1 24.27,15.12 U$19.P$1
N$45
  Top 0.305: IC1.1 IC1.2 28.08,34.12 RLP1.1
N$46
  Top 0.305: R5.2 26.19,35.89 RLP1.2 28.15,37.24 C49.2
N$47
  Top 0.305: RLP2.2 28.69,22.88 C50.2 28.72,20.84 C51.2
N$48
  Top 0.305: C51.1 30.44,19.02 RHP1.2 29.31,16 27,16 26,17 26,19 27.11,20.1 R9.2
N$49
  Top 0.305: IC1.6 25.48,31.47 25,31 22.31,31 R4.2
N$50
  Top 0.305: R5.1 26.14,32.36 IC1.5
N$51
  Top 0.305: D1.1 23.96,33.21 IC1.7
N$52
  Top 0.305: IC2.2 IC2.1 35.72,17.13 C54.2
N$53
  Top 0.305: C54.1 37.86,15.15 R12.2 39.97,15.18 RLP3.2
N$54
  Top 0.305: R9.1 26.12,25.6 IC1.10
N$55
  Top 0.305: D2.1 24.22,25.22 24.83,25.82 IC1.8
N$56
  Top 0.305: R8.2 IC1.9
N$57
  Top 0.305: IC1.13 IC1.14 RLP2.1
N$58
  Top 0.305: C55.2 32.14,28.71 RLP4.2 35.09,29.43 C56.2
N$59
  Top 0.305: C56.1 37.05,31.06 | RHP2.2 36.79,32.94 C56.1 | R15.2 37.14,30.71 C56.1
N$60
  Top 0.305: R11.2 38.97,19.71 IC2.6
N$61
  Top 0.305: R12.1 38.32,17.31 IC2.5
N$62
  Top 0.305: D3.1 40.81,20.74 IC2.7
N$63
  Top 0.305: IC2.8 40.94,27.9 D4.1
N$64
  Top 0.305: R15.1 38.32,27.93 IC2.10
N$65
  Top 0.305: R14.2 39.5,28.65 39.5,28 38.97,27.47 IC2.9
N$66
  Top 0.305: IC2.13 IC2.14 35.28,27.01 RLP4.1
NEO_IN  (via drill 0.6)
  Top 0.305: U$4.11 30.18,52 v29,52 | v56,55 57,54 RNEO.1
  Bottom 0.305: v29,52 32,55 38,55 39,54 48,54 49,55 v56,55
SWCLK
  Top 0.305: U$4.45 33.13,60.87 33,61 33,64 34,65 34,67 33.5,67.5 29,67.5 28.74,67.76 J3.4
  Top 0.406: J3.4
SWDIO
  Top 0.305: J3.2 26.08,69.08 25,68 25,64 29,60 32,60 32.62,59.38 U$4.46
VBAT  (via drill 0.6)
  Top 0.305: R1.1 23.64,46.54 arc-90 C6.1 23.68,46.18 | BQ21040.2 57.15,33.55 RCHRG.1 | C34.1 56.35,31 RCHRG.1 | v58,29 58,30.15 RCHRG.1
  Top 0.406: R1.1 23,49.73 23,54 22.65,54.35 U2.1 16.55,54.45 v16,55 | S1.1 57.15,30.66 RCHRG.1 | v23.75,10.25 20.75,10.25 v15,16
  Bottom 0.305: C9.1 48.6,63.6 52,67 54.16,67 C11.1 | 69.82,31 66,31 65,30 59,30 v58,29 | C3.1 70.85,41.7 C23.1
  Bottom 0.406: C3.1 70.85,47.4 NEO1.1 67.72,51.69 NEO2.1 61.01,63.74 C24.1 60.42,64.91 | NEO23.1 70.81,33.22 C18.1 69.82,31 69.82,28.66 C19.1 66.42,24.78 NEO22.1 67.58,23.38 C20.1 | NEO21.1 63.6,19.23 C20.1 | C20.1 58.78,14.58 C21.1 57.03,14.28 NEO20.1 49.32,12.28 C22.1 NEO19.1 47.4,9.15 C31.1 | NEO18.1 38,7.3 C31.1 | C31.1 35.81,9.15 C32.1 34.18,10.15 NEO17.1 29.64,8.36 29,9 28.69,9 C17.1 27.43,9.43 27,9 25.15,9 NEO16.1 24.97,9.03 v23.75,10.25 | v15,16 15,17.4 NEO15.1 15.92,17.92 C26.1 14.58,22.22 C27.1 14.28,22.97 NEO14.1 11.18,24.08 C28.1 10.38,32.02 NEO13.1 11.15,34.6 C29.1 | C29.1 10.85,41.7 NEO12.1 | C29.1 8.36,44.79 NEO11.1 9.15,46.82 C30.1 11,47.04 11,53 12.74,54.74 13,54.74 | 13,54.74 C13.1 14.84,55 v16,55 | 13,54.74 12.17,55.56 NEO10.1 12.17,59.17 NEO9.1 15.92,62.08 C25.1 22.22,65.43 C15.1 | NEO8.1 22.97,66.72 C15.1 | C15.1 27.97,69.13 C16.1 32.02,69.18 NEO7.1 32.6,70.85 C12.1 | C12.1 41.7,71.15 NEO6.1 | C12.1 42.79,71.64 NEO5.1 47.82,71.43 C10.1 47.82,64.18 C9.1 | C11.1 56.14,67.83 NEO4.1 59.53,64.91 60.42,64.91 | 60.42,64.91 NEO3.1
VBUS  (via drill 0.5, 0.6)
  Top 0.305: BQ51013B.4 57.51,44.14 C38.2 59.19,42 v58,42 | 58,38 C33.1 | 58,38 57,37 BQ21040.5 | 58,38 v58,39 63,39 65.37,41.37 WCHRG.A | U$3.6 56,50 v56,48
  Top 0.406: J4.1 65.37,37.17 WCHRG.A
  Bottom 0.305: v58,39 v58,42 56,44 v56,48
VDDCORE
  Top 0.305: U$4.43 34.15,60.14 C1.1
VUSB
  Top 0.305: BQ51013B.9 56.64,46.64 57,47 57,48.08 C44.1 58,49.08 58,52 57.39,52.62 U$3.4 55.39,52.62 54,54 52,54 43,63 43,73.65 J1.VBUS
WCHRG
  Top 0.305: WCHRG.C 65.37,44.47 RLED.2

### Text on the board
tPlace: Reset
tNames: Made By Sam Deghuee / 2017
_tNames: TP6 | TP4 | C12 | X1 | C1 | U1 | C5 | C11 | C2 | U$4 | LED1 | RPULL1 | C4 | X2 | RPULL2 | RLED3 | C14 | RLED1 | R1 | RLED2 | C6 | U2 | C7 | RF1 | C3 | RS1 | U$3 | C8 | C10 | RS2 | RF2 | TEMPSENSE | U$9 | C9 | TP8
_bNames: TP5 | TP3 | J1 | RJ+ | RJ- | TP1 | TP2 | TP7
200bmp: /home/samtopu/Downloads/flat,800x800,070,f.u2.bmp
201bmp: C:/Users/sdegh/Desktop/v7nqiV3q.bmp